# EAGLE design MegaShield-SMD (EAGLE 8.5.0)
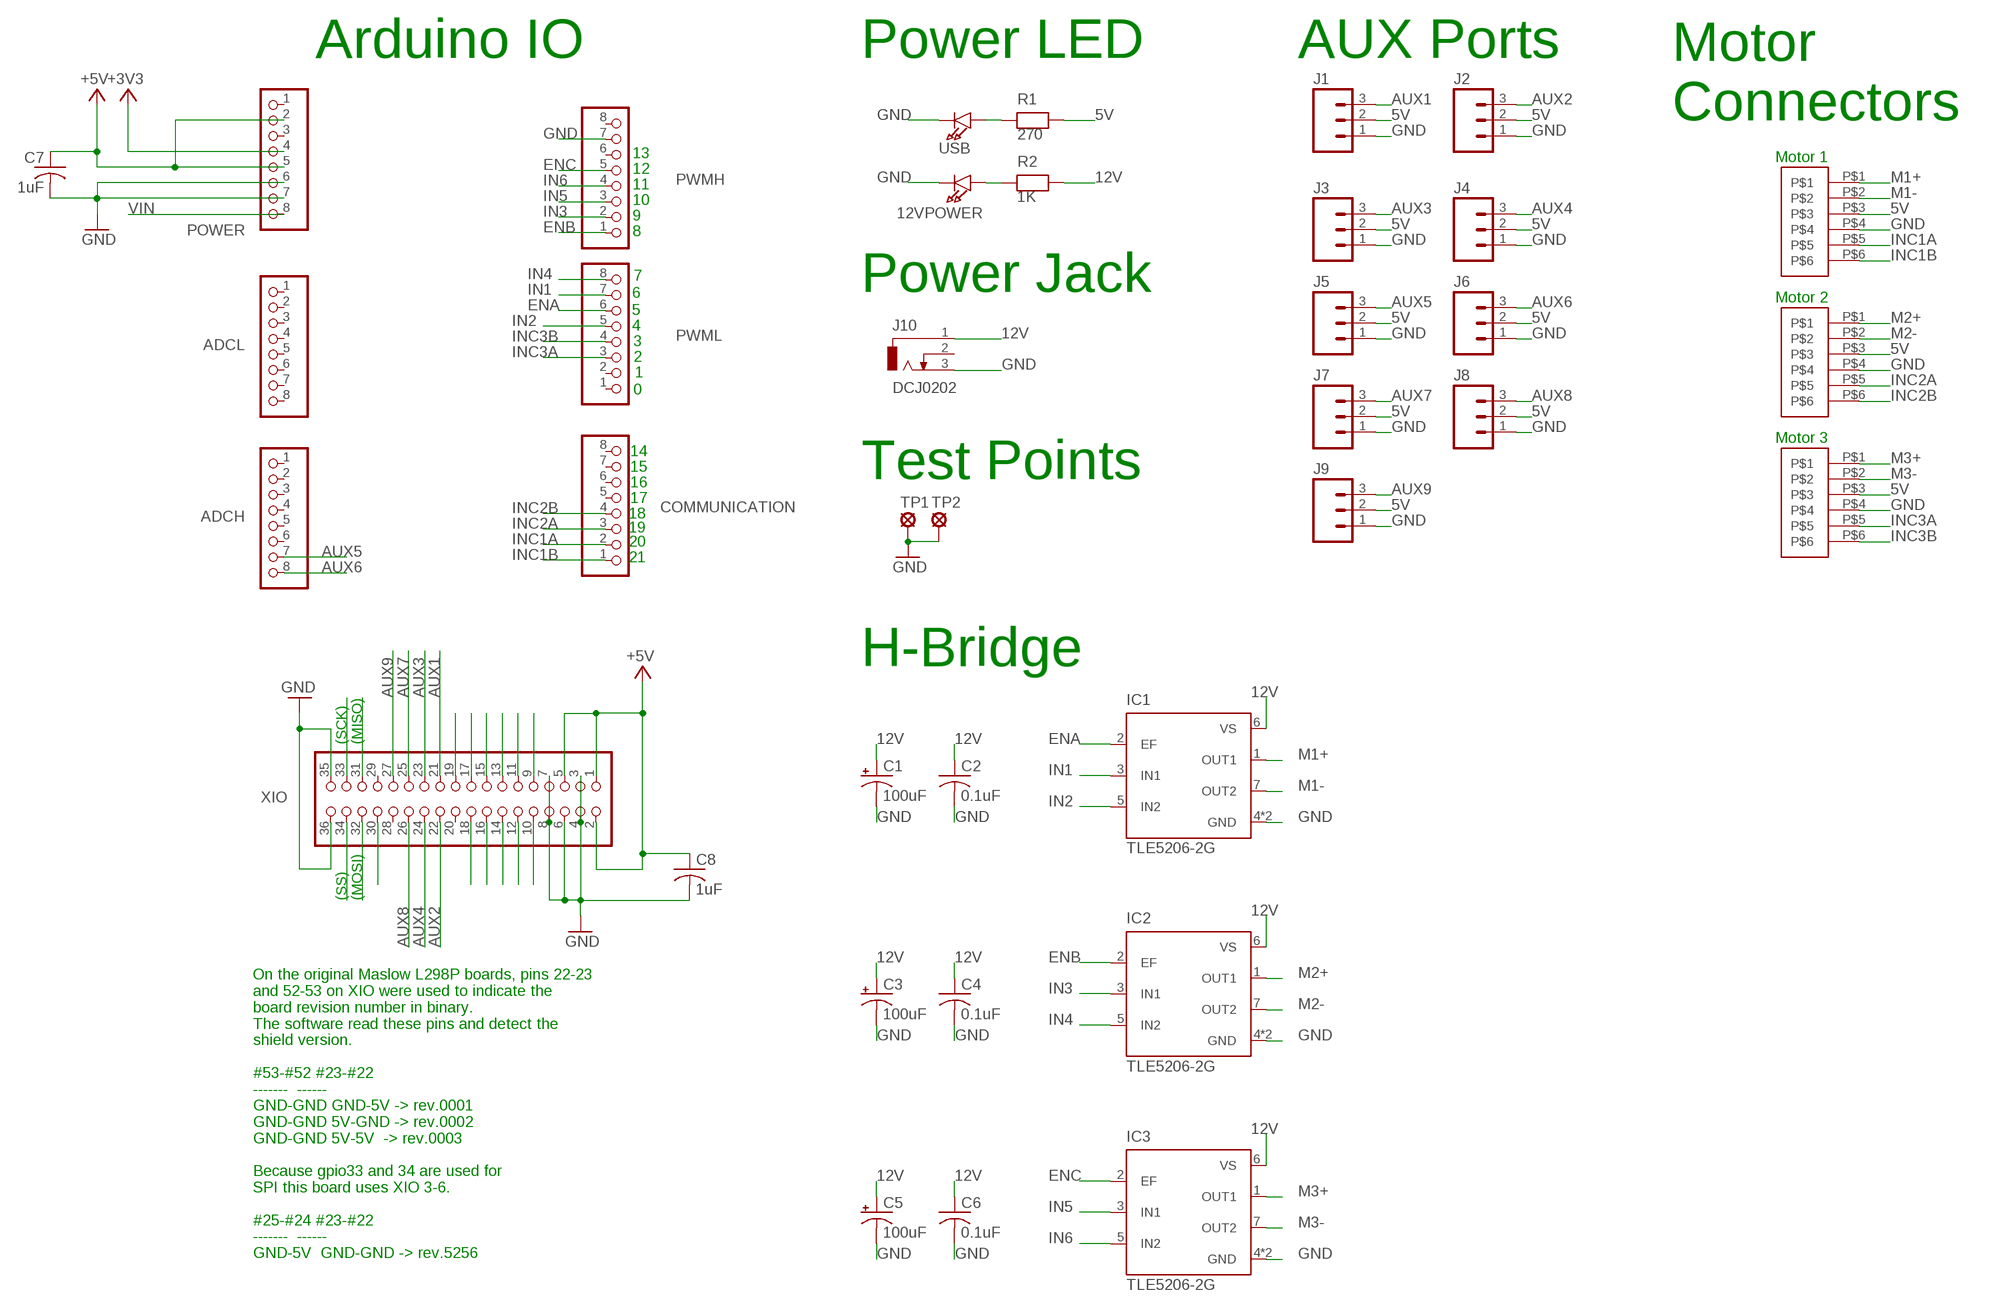
[diagram p0: schematic, sheet 1]

## Parts
12VPOWER  LED1206  [CHIPLED_1206]
ADCH  8x1F-H8.5  PINHD-1X8  [1X08]
ADCL  PINHD-1X8  [1X08]
C1  100uF  CAP_POLE  [PANASONIC_E]
C2  0.1uF  C-USC0805K  [C0805K]
C3  100uF  CAP_POLE  [PANASONIC_E]
C4  0.1uF  C-USC0805K  [C0805K]
C5  100uF  CAP_POLE  [PANASONIC_E]
C6  0.1uF  C-USC0805K  [C0805K]
C7  1uF  C-USC0805K  [C0805K]
C8  1uF  C-USC0805K  [C0805K]
COMMUNICATION  PINHD-1X8  [1X08]
IC1  TLE5206-2G  [INF-PG-TO263-7-1_L_1PRIMARY]
IC2  TLE5206-2G  [INF-PG-TO263-7-1_L_1PRIMARY]
IC3  TLE5206-2G  [INF-PG-TO263-7-1_L_1PRIMARY]
J1  M03LOCK  [1X03_LOCK]
J2  M03LOCK  [1X03_LOCK]
J3  M03LOCK  [1X03_LOCK]
J4  M03LOCK  [1X03_LOCK]
J5  M03LOCK  [1X03_LOCK]
J6  M03LOCK  [1X03_LOCK]
J7  M03LOCK  [1X03_LOCK]
J8  M03LOCK  [1X03_LOCK]
J9  M03LOCK  [1X03_LOCK]
J10  DCJ0202  [DCJ0202]
MP1  JST-PH-6  [JST-PHR-6-SMD]
MP2  JST-PH-6  [JST-PHR-6-SMD]
MP3  JST-PH-6  [JST-PHR-6-SMD]
POWER  8x1F-H8.5  PINHD-1X8  [1X08]
PWMH  PINHD-1X8  [1X08]
PWML  PINHD-1X8  [1X08]
R1  270  RESISTOR0805  [0805]
R2  1K  RESISTOR0805  [0805]
TP1  LSP10  [LSP10]
TP2  LSP10  [LSP10]
USB  LED1206  [CHIPLED_1206]
XIO  18x2F-H8.5  PINHD-2X18  [2X18]

## Nets
5V: C7.1 C8.1 J1.2 J2.2 J3.2 J4.2 J5.2 J6.2 J7.2 J8.2 J9.2 MP1.P$3 MP2.P$3 MP3.P$3 POWER.2 POWER.5 R1.2 XIO.1 XIO.2 XIO.5 ; supply symbol labelled +5V
12V: C1.+ C2.1 C3.+ C4.1 C5.+ C6.1 IC1.6(VS) IC2.6(VS) IC3.6(VS) J10.1 R2.2
+3V3 [power]: POWER.4
AUX1: J1.3 XIO.21
AUX2: J2.3 XIO.22
AUX3: J3.3 XIO.23
AUX4: J4.3 XIO.24
AUX5: ADCH.7 J5.3
AUX6: ADCH.8 J6.3
AUX7: J7.3 XIO.25
AUX8: J8.3 XIO.26
AUX9: J9.3 XIO.27
ENA: IC1.2(EF) PWML.6
ENB: IC2.2(EF) PWMH.1
ENC: IC3.2(EF) PWMH.5
GND [gnd]: 12VPOWER.C C1.- C2.2 C3.- C4.2 C5.- C6.2 C7.2 C8.2 IC1.4(GND) IC1.8(GND) IC2.4(GND) IC2.8(GND) IC3.4(GND) IC3.8(GND) J1.1 J2.1 J3.1 J4.1 J5.1 J6.1 J7.1 J8.1 J9.1 J10.3 MP1.P$4 MP2.P$4 MP3.P$4 POWER.6 POWER.7 PWMH.7 TP1.MP TP2.MP USB.C XIO.3 XIO.4 XIO.6 XIO.7 XIO.8 XIO.35 XIO.36
IN1: IC1.3(IN1) PWML.7
IN2: IC1.5(IN2) PWML.5
IN3: IC2.3(IN1) PWMH.2
IN4: IC2.5(IN2) PWML.8
IN5: IC3.3(IN1) PWMH.3
IN6: IC3.5(IN2) PWMH.4
INC1A: COMMUNICATION.2 MP1.P$5
INC1B: COMMUNICATION.1 MP1.P$6
INC2A: COMMUNICATION.3 MP2.P$5
INC2B: COMMUNICATION.4 MP2.P$6
INC3A: MP3.P$5 PWML.3
INC3B: MP3.P$6 PWML.4
M1+: IC1.1(OUT1) MP1.P$1
M1-: IC1.7(OUT2) MP1.P$2
M2+: IC2.1(OUT1) MP2.P$1
M2-: IC2.7(OUT2) MP2.P$2
M3+: IC3.1(OUT1) MP3.P$1
M3-: IC3.7(OUT2) MP3.P$2
N$2: R1.1 USB.A
N$3: 12VPOWER.A R2.1
PA6: XIO.9
PA7: XIO.10
PB0: XIO.34
PB1: XIO.33
PB2: XIO.32
PB3: XIO.31
PC0: XIO.18
PC1: XIO.17
PC2: XIO.16
PC3: XIO.15
PC4: XIO.14
PC5: XIO.13
PC6: XIO.12
PC7: XIO.11
PD7: XIO.19
PL0: XIO.30
VIN [power]: POWER.8
Unconnected: ADCH.1 ADCH.2 ADCH.3 ADCH.4 ADCH.5 ADCH.6 ADCL.1 ADCL.2 ADCL.3 ADCL.4 ADCL.5 ADCL.6 ADCL.7 ADCL.8 COMMUNICATION.5 COMMUNICATION.6 COMMUNICATION.7 COMMUNICATION.8 J10.2 POWER.1 POWER.3 PWMH.6 PWMH.8 PWML.1 PWML.2 XIO.20 XIO.28 XIO.29

## Notes on the sheet
- Arduino IO | Power LED | AUX Ports
- Motor
  Connectors
- Motor 1
- 13
- 12
- 11
- 10
- 9
- 8
- 7
- Power Jack | Motor 2
- 6
- 5
- 4
- 3
- 2
- 1
- 0
- Motor 3
- 14
- 15
- Test Points
- 16
- 17
- 18
- 19
- 20
- 21
- H-Bridge
- (SCK) | (MISO)
- (SS) | (MOSI)
- On the original Maslow L298P boards, pins 22-23
  and 52-53 on XIO were used to indicate the 
  board revision number in binary. 
  The software read these pins and detect the 
  shield version.
  
  #53-#52 #23-#22
  -------  ------
  GND-GND GND-5V -> rev.0001
  GND-GND 5V-GND -> rev.0002
  GND-GND 5V-5V  -> rev.0003
  
  Because gpio33 and 34 are used for 
  SPI this board uses XIO 3-6.
  
  #25-#24 #23-#22
  -------  ------
  GND-5V  GND-GND -> rev.5256

## Library data of the parts
12VPOWER USB = microbuilder:LED: LED 0603 - 0603 Surface Mount Package Green LED - Low Power (3.9mcd, 2ma, 1.7Vf) Orange LED - Low Power (9.8mcd, 2ma, 1.8Vf) Red LED - Low Power (5mcd, 2ma, 1.8Vf) Yellow LED - Low Power (7mcd, 2ma, 1.8Vf) 0805 - 0805 Surface Mount Package Red LED (104mcd, 20mA, Diffused) - LS R976 [Digikey: 475-1278-6-ND] Red LED (12mcd, 20mA, 2.0Vf, Clear) - APT2012EC [Digikey: 754-1128-1-ND] Green LED (15mcd, 20mA, 2.2Vf, Clear) - APT2012GC [Digikey: 754-1131-1-ND] White LED (160mcd, 20mA, 2.1Vf, Clear) - APT2012SECK [Digikey: 754-1130-1-ND] 1206 - 1206 Surface Mount Package Green LED (26mcd, 20mA, Diffused) - LG N971 [Digikey: 475-1407-6-ND] Red LED (15mcd, 20mA, Diffused) - LH N974 [Digikey: 475-1416-6-ND]
ADCH POWER = SmartPrj:PINHD-1X8: PIN HEADER
ADCL COMMUNICATION PWMH PWML = pinhead:PINHD-1X8: PIN HEADER
C1 C3 C5 = SparkFun:CAP_POL: Capacitor Polarized These are standard SMD and PTH capacitors. Normally 10uF, 47uF, and 100uF in electrolytic and tantalum varieties. Always verify the external diameter of the through hole cap, it varies with capacity, voltage, and manufacturer. The EIA devices should be standard.
C2 C4 C6-C8 = adafruit:C-US: CAPACITOR, American symbol
IC1 IC2 = TLE5206-fixed:TLE5206-2G: PG-TO263-7-1 package , TAB is GND
IC3 = TLE5206-fixed:TLE5206-2G: PG-TO263-7-1 package , TAB is GND; DIGIKEY: TLE5206-2S-ND
J1-J9 = SparkFun-Connectors:M03: Header 3 Standard 3-pin 0.1" header. Use with straight break away headers (SKU : PRT-00116), right angle break away headers (PRT-00553), swiss pins (PRT-00743), machine pins (PRT-00117), and female headers (PRT-00115). Molex polarized connector foot print use with SKU : PRT-08232 with associated crimp pins and housings.
J10 = con-jack:DCJ0202: DC POWER JACK Source: DCJ0202.pdf; OC_FARNELL: unknown; OC_NEWARK: unknown
MP1-MP3 = JST-CON:JST-PH-6
R1 R2 = microbuilder:RESISTOR: Resistors 0603 - 0603 Surface Mount Package 0 Ohm 1/10 Watt 1% Resistor 15 Ohm 1/10 Watt 1% Resistor 33 Ohm 1/10 Watt 1% Resistor 49.9 Ohm 1/10 Watt 1% Resistor 100 Ohm 1/10 Watt 1% Resistor 150 Ohm 1/10 Watt 1% Resistor 240 Ohm 1/10 Watt 1% Resistor 390 Ohm 1/10 Watt 1% Resistor 560 Ohm 1/10 Watt 1% Resistor 1.0K Ohm 1/10 Watt 1% Resistor 1.5K Ohm 1/10 Watt 1% Resistor 2.0K Ohm 1/10 Watt 1% Resistor 10.0K Ohm 1/10 Watt 1% Resistor 20.0K Ohm 1/10 Watt 1% Resistor 33.0K Ohm 1/10 Watt 1% Resistor 100.0K Ohm 1/10 Watt 1% Resistor 0805 - 0805 Surface Mount Package 0 Ohm 1/8 Watt 1% Resistor 33 Ohm 1/8 Watt 1% Resistor 100 Ohm 1/8 Watt 1% Resistor 150 Ohm 1/8 Watt 1% Resistor 200 Ohm 1/8 Watt 1% Resistor 240 Ohm 1/8 Watt 1% Resistor 330 Ohm 1/8 Watt 1% Resistor 390 Ohm 1/8 Watt 1% Resistor 470 Ohm 1/8 Watt 1% Resistor 1.0K Ohm 1/8 Watt 1% Resistor 1.5K Ohm 1/8 Watt 1% Resistor 2.0K Ohm 1/8 Watt 1% Resistor 4.7K Ohm 1/8 Watt 1% Resistor 5.1K Ohm 1/8 Watt 1% Resistor 5.6K Ohm 1/8 Watt 1% Resistor 10.0K Ohm 1/8 Watt 1% Resistor 22.0K Ohm 1/8 Watt 1% Resistor 33.0K Ohm 1/8 Watt 1% Resistor 100K Ohm 1/8 Watt 1% Resistor 1206 - 1206 Surface Mount Package
TP1 TP2 = solpad:LSP10: SOLDER PAD drill 1.0 mm, distributor Buerklin, 12H555
XIO = SmartPrj:PINHD-2X18: PIN HEADER

## Net classes
1 power: width 0.61 mm, drill 0.711 mm, clearance 0.203 mm
2 gnd: width 0.305 mm, drill 0.711 mm, clearance 0.203 mm
3 usbvcc: width 0.508 mm, drill 0.711 mm, clearance 0.203 mm

## Board
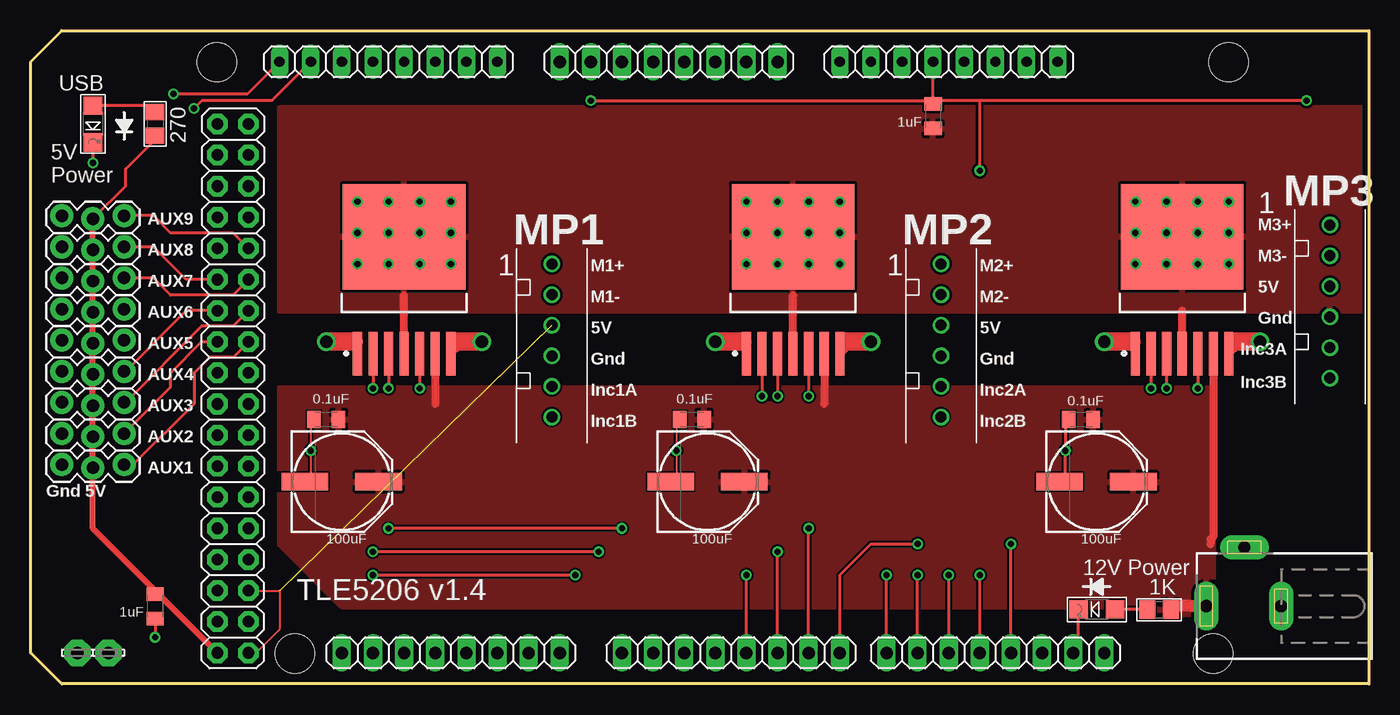
[diagram p1: board, top side]
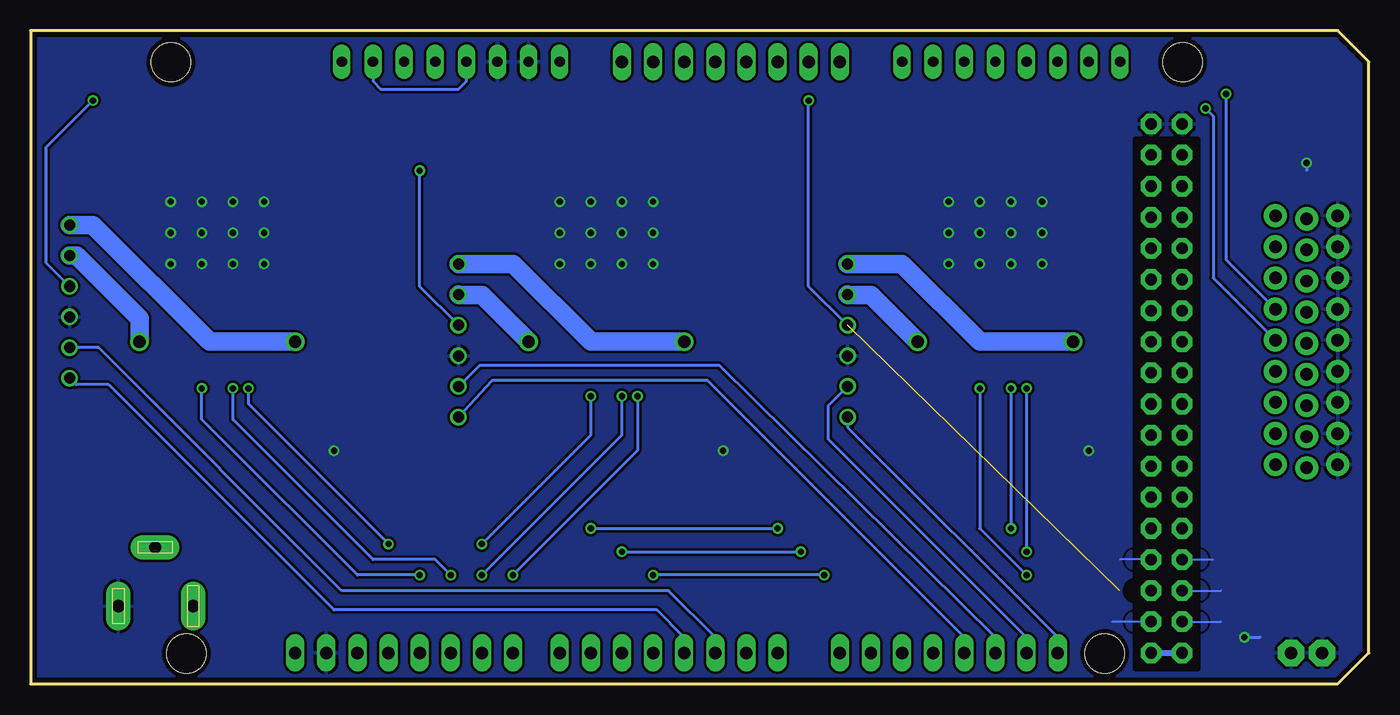
[diagram p2: board, bottom side, seen from below]

Size 109.22 x 53.34 mm. Coordinates in mm from the lower left corner, seen from the top.
Outline: 2.54,0 0,2.54 0,50.8 2.53,53.34 109.22,53.34 109.22,0 2.54,0
Copper layers (1*16): Top 0.0356mm / dielectric 1.5011mm / Bottom 0.0356mm
Design rules "PCBs_io *": minimum track width 6mil, minimum drill 13mil, track to track 6mil, track to pad 6mil, pad to pad 6mil, via to via 6mil, smd to smd 6mil, copper to edge 15mil, drill to drill 6mil, minimum pad ring 7mil, minimum via ring 7mil, stop-mask expansion 3mil, vias tented up to drill 0mil, thermal gap 10mil
Holes 3.2 mm at 15.22,50.76 96.5,2.5 21.57,2.5 97.77,50.76
tRestrict: area 13,6.7 to 14.9,8.6; area 13,4.1 to 14.9,6; area 18.1,4.1 to 20,6; area 18.1,6.7 to 20,8.6; area 13,9.2 to 14.9,11.1; area 18.1,9.2 to 20,11.1
bRestrict: area 14,1.3 to 19.1,44.5; area 13,9.2 to 14.9,11.1; area 18.1,9.2 to 20,11.1; area 18.1,6.7 to 20,8.6; area 18.1,4.1 to 20,6; area 13,4.1 to 14.9,6; area 13,6.7 to 14.9,8.6

### Footprints (pad centres in the part's own frame; a part is rotated, then mirrored left to right if it is on the bottom)
CHIPLED_1206 = smd 1.5 x 1.5: A 0,-1.496; C 0,1.496
1X08 = drill 0.85 pad 1.422 long: 1 -8.89,0; 2 -6.35,0; 3 -3.81,0; 4 -1.27,0; 5 1.27,0; 6 3.81,0; 7 6.35,0; 8 8.89,0
1X08' = drill 1.016 long: 1 -8.89,0; 2 -6.35,0; 3 -3.81,0; 4 -1.27,0; 5 1.27,0; 6 3.81,0; 7 6.35,0; 8 8.89,0
PANASONIC_E = smd 3.8 x 1.4: + 3,0; - -3,0
C0805K = smd 1.1 x 1.4: 1 -1,0; 2 1,0
INF-PG-TO263-7-1_L_1PRIMARY = smd 3.55 x 0.75: 1 -6.05,3.81; 2 -6.05,2.54; 3 -6.05,1.27; 4 -6.05,0; 5 -6.05,-1.27; 6 -6.05,-2.54; 7 -6.05,-3.81 | smd 8.6 x 10: 8 3.5,0
1X03_LOCK = drill 1.016 pad 1.88: 1 0,0.127; 2 2.54,-0.127; 3 5.08,0.127
DCJ0202 = drill 1 pad 2 long: 1 0,3.1; 2 4.8,0; 3 0,-3
JST-PHR-6-SMD = drill 0.9: P$1 0,0; P$2 2.5,0; P$3 5,0; P$4 7.5,0; P$5 10,0; P$6 12.5,0
0805 = smd 1.3 x 1.5: 1 -0.95,0; 2 0.95,0
LSP10 = drill 1.016 pad 2.159 octagon: MP 0,0
2X18 = drill 0.95 pad 1.676 octagon: 1 -21.59,-1.27; 2 -21.59,1.27; 3 -19.05,-1.27; 4 -19.05,1.27; 5 -16.51,-1.27; 6 -16.51,1.27; 7 -13.97,-1.27; 8 -13.97,1.27; 9 -11.43,-1.27; 10 -11.43,1.27; 11 -8.89,-1.27; 12 -8.89,1.27; 13 -6.35,-1.27; 14 -6.35,1.27; 15 -3.81,-1.27; 16 -3.81,1.27; 17 -1.27,-1.27; 18 -1.27,1.27; 19 1.27,-1.27; 20 1.27,1.27; 21 3.81,-1.27; 22 3.81,1.27; 23 6.35,-1.27; 24 6.35,1.27; 25 8.89,-1.27; 26 8.89,1.27; 27 11.43,-1.27; 28 11.43,1.27; 29 13.97,-1.27; 30 13.97,1.27; 31 16.51,-1.27; 32 16.51,1.27; 33 19.05,-1.27; 34 19.05,1.27; 35 21.59,-1.27; 36 21.59,1.27

### Placement (x,y rotation side)
12VPOWER  87.02,6.09 90 top
ADCH  29.21,50.8 180 top
ADCL  [1X08']  52.07,50.8 0 top
C1  25.4,16.51 0 top
C2  24.13,21.59 180 top
C3  55.24,16.51 0 top
C4  53.98,21.59 180 top
C5  87,16.51 0 top
C6  85.72,21.59 180 top
C7  10.16,6.35 270 top
C8  73.66,46.35 270 top
COMMUNICATION  [1X08']  34.29,2.54 0 top
IC1  30.48,33.02 90 top
IC2  62.23,33.02 90 top
IC3  93.98,33.02 90 top
J1  2.54,17.78 0 top
J2  2.54,20.32 0 top
J3  2.54,22.86 0 top
J4  2.54,25.4 0 top
J5  2.54,27.94 0 top
J6  2.54,30.48 0 top
J7  2.54,33.02 0 top
J8  2.54,35.56 0 top
J9  2.54,38.1 0 top
J10  99.06,6.35 90 top
MP1  42.55,34.29 270 top
MP2  74.3,34.29 270 top
MP3  106.05,37.47 270 top
POWER  74.93,50.8 180 top
PWMH  [1X08']  78.74,2.54 0 top
PWML  [1X08']  57.15,2.54 0 top
R1  10.16,45.72 270 top
R2  92.1,6.07 0 top
TP1  3.81,2.54 0 top
TP2  6.35,2.54 0 top
USB  5.08,45.72 180 top
XIO  16.51,24.13 90 top

### Tracks (layer width: path | path; a pad name or v marks a point on that pad's centre or on a via)
5V  (via drill 0.51)  (1 unrouted)
  Top 0.152: XIO.5 20.32,7.62 20.32,4.45 18.41,2.54 XIO.1 | C7.1 10.16,7.62
  Top 0.254: v45.72,47.62 73.66,47.62 | 73.66,47.62 C8.1 POWER.5 | J9.2 7.75,40.64 7.75,42.04 10.16,44.45 R1.2 | v104.14,47.62 77.47,47.62 | 77.47,47.62 73.66,47.62 | v77.47,41.91 77.47,47.62
  Top 0.508: XIO.2 10.16,7.62 5.08,12.7 J1.2 J2.2 J3.2 J4.2 J5.2 J6.2 J7.2 J8.2 J9.2
  Bottom 0.254: POWER.2 81.28,49.21 80.64,48.58 74.3,48.58 73.66,49.21 POWER.5 | MP1.P$3 45.72,32.47 v45.72,47.62 | MP2.P$3 77.47,32.47 v77.47,41.91 | MP3.P$3 107.95,34.37 107.95,43.81 v104.14,47.62
  Bottom 0.508: XIO.1 XIO.2
12V
  Top 0.254: R2.2 93.39,6.41
  Top 0.635: IC1.6 33.02,22.86 | IC2.6 64.77,22.86 | IC3.6 96.52,12.02 96.32,11.82 96.32,11.43
  Top 1.016: 93.39,6.41 J10.1
  pour Top: 20.32,24.13 20.32,11.43 25.4,6.35 88.9,6.35 90.81,5.71 96.52,5.71 96.52,24.13
AUX1
  Top 0.254: XIO.21 16.51,26.67 14.61,26.67 13.34,25.4 13.34,22.86 8.38,17.91 J1.3
AUX2
  Top 0.254: J2.3 11.43,24.26 11.43,25.4 13.97,27.94 XIO.22
AUX3
  Top 0.254: XIO.23 16.51,29.21 13.97,29.21 7.62,22.86 J3.3
AUX4
  Top 0.254: XIO.24 12.7,30.48 7.62,25.4 J4.3
AUX5  (via drill 0.51)
  Top 0.254: ADCH.7 19.68,47.62 13.97,47.62 v13.34,46.99
  Bottom 0.254: v13.34,46.99 12.7,46.35 12.7,33.15 J5.3
AUX6  (via drill 0.51)
  Top 0.254: v11.66,48.18 17.7,48.18 ADCH.8
  Bottom 0.254: J6.3 11.66,34.65 v11.66,48.18
AUX7
  Top 0.254: XIO.25 16.51,31.75 11.43,31.75 10.03,33.15 J7.3
AUX8
  Top 0.254: XIO.26 12.7,33.02 10.03,35.69 J8.3
AUX9
  Top 0.254: XIO.27 16.51,36.83 11.43,36.83 10.03,38.23 J9.3
ENA  (via drill 0.51)
  Top 0.254: PWML.6 v60.96,10.79 | IC1.2 v27.94,24.13 | v46.35,10.79 v27.94,10.79
  Bottom 0.254: v27.94,24.13 v27.94,10.79 | v60.96,10.79 v46.35,10.79
ENB  (via drill 0.51)
  Top 0.254: PWMH.1 v69.85,8.89 | IC2.2 v59.69,23.5
  Bottom 0.254: v69.85,8.89 59.69,19.05 v59.69,23.5
ENC  (via drill 0.51)
  Top 0.254: IC3.2 v91.44,24.13 | PWMH.5 v80.01,11.43
  Bottom 0.254: v80.01,11.43 91.44,22.86 v91.44,24.13
GND  (via drill 0.51)
  Top 0.152: C2.2 22.86,21.32 v22.86,19.05 22.86,16.51 C1.- | C4.2 52.7,21.59 v52.7,19.05 52.7,16.51 C3.-
  Top 0.254: PWMH.7 85.52,2.97 12VPOWER.C | C5.- 84.45,16.51 v84.45,19.05 84.45,21.32 arc-90 C6.2 | C7.2 v10.16,3.81 | USB.C v5.08,42.55
  Top 0.635: IC3.4 93.98,30.48 | IC2.4 62.23,31.75 | IC1.4 30.48,31.75
  Bottom 0.152: XIO.4 12.06,5.08 | XIO.3 20.95,5.08 | XIO.6 12.06,7.62 | XIO.8 12.7,10.16 | XIO.7 20.32,10.16
  Bottom 0.254: v10.16,3.81 8.89,3.81 | v5.08,42.55 5.08,41.91
  other vias: 26.67,39.37 29.21,39.37 31.75,39.37 34.29,39.37 26.67,36.83 29.21,36.83 31.75,36.83 34.29,36.83 26.67,34.29 29.21,34.29 31.75,34.29 34.29,34.29 58.42,39.37 60.96,39.37 63.5,39.37 66.04,39.37 58.42,36.83 60.96,36.83 63.5,36.83 66.04,36.83 58.42,34.29 60.96,34.29 63.5,34.29 66.04,34.29 90.17,39.37 92.71,39.37 95.25,39.37 97.79,39.37 90.17,36.83 92.71,36.83 95.25,36.83 97.79,36.83 90.17,34.29 92.71,34.29 95.25,34.29 97.79,34.29
  pour Bottom: 2.54,53.34 109.22,53.34 109.22,0 2.54,0 0,2.54 0,50.8
  pour Top: 20.32,46.99 20.32,30.48 109.22,30.48 109.22,46.99
IN1  (via drill 0.51)
  Top 0.254: PWML.7 v63.5,12.7 | IC1.3 v29.21,24.13 | v48.26,12.7 v29.21,12.7
  Bottom 0.254: v29.21,24.13 v29.21,12.7 | v63.5,12.7 v48.26,12.7
IN2  (via drill 0.51)
  Top 0.254: PWML.5 v58.42,8.89 | v27.94,8.89 v44.45,8.89 | IC1.5 v31.75,24.13
  Bottom 0.254: v31.75,24.13 31.75,12.7 v27.94,8.89 | v44.45,8.89 v58.42,8.89
IN3  (via drill 0.51)
  Top 0.254: IC2.3 v60.96,23.5 | PWMH.2 v72.39,8.89
  Bottom 0.254: v72.39,8.89 60.96,20.32 v60.96,23.5
IN4  (via drill 0.51)
  Top 0.254: IC2.5 v63.5,23.5 | PWML.8 66.04,8.89 68.58,11.43 v72.39,11.43
  Bottom 0.254: v72.39,11.43 63.5,20.32 v63.5,23.5
IN5  (via drill 0.51)
  Top 0.254: IC3.3 v92.71,24.13 | PWMH.3 v74.93,8.89
  Bottom 0.254: v74.93,8.89 76.2,10.16 81.28,10.16 92.71,21.59 v92.71,24.13
IN6  (via drill 0.51)
  Top 0.254: IC3.5 v95.25,24.13 | PWMH.4 v77.47,8.89
  Bottom 0.254: v77.47,8.89 82.55,8.89 93.98,20.32 95.25,21.59 v95.25,24.13
INC1A
  Bottom 0.254: COMMUNICATION.2 27.94,3.81 44.13,20 44.13,22.7 MP1.P$5
INC1B
  Bottom 0.254: MP1.P$6 42.55,20.95 25.4,3.81 COMMUNICATION.1
INC2A
  Bottom 0.254: MP2.P$5 72.55,26.04 53.02,26.04 30.48,3.81 COMMUNICATION.3
INC2B
  Bottom 0.254: COMMUNICATION.4 33.02,3.81 53.98,24.77 71.56,24.77 MP2.P$6
INC3A
  Bottom 0.254: PWML.3 53.34,3.81 57.15,7.62 83.82,7.62 103.67,27.46 MP3.P$5
INC3B
  Bottom 0.254: PWML.4 55.88,3.81 58.1,6.03 84.45,6.03 102.87,24.44 105.52,24.44 MP3.P$6
M1+  (via drill 1.02)
  Top 0.635: 26.04,27.94 26.67,27.3 IC1.1
  Top 1.524: v24.13,27.94 26.04,27.94 26.35,27.94
  Bottom 1.524: v24.13,27.94 31.75,27.94 38.1,34.29 MP1.P$1
M1-  (via drill 1.02)
  Top 0.635: 34.92,27.94 34.92,27.61 IC1.7
  Top 1.524: v36.83,27.94 34.92,27.94
  Bottom 1.524: MP1.P$2 42.51,31.75 40.64,31.75 v36.83,27.94
M2+  (via drill 1.02)
  Top 0.635: 57.78,27.94 58.42,27.3 IC2.1
  Top 1.524: v55.88,27.94 57.78,27.94 58.1,27.94
  Bottom 1.524: MP2.P$1 69.85,34.29 63.5,27.94 v55.88,27.94
M2-  (via drill 1.02)
  Top 0.635: 66.67,27.94 66.67,27.61 IC2.7
  Top 1.524: v68.58,27.94 66.67,27.94
  Bottom 1.524: MP2.P$2 74.25,31.75 72.39,31.75 v68.58,27.94
M3+  (via drill 1.02)
  Top 0.635: 89.53,27.94 90.17,27.3 IC3.1
  Top 1.524: v87.63,27.94 89.53,27.94 89.85,27.94
  Bottom 1.524: MP3.P$1 104.14,37.47 94.61,27.94 v87.63,27.94
M3-  (via drill 1.02)
  Top 0.635: 98.42,27.94 98.42,27.61 IC3.7
  Top 1.524: v100.33,27.94 98.42,27.94
  Bottom 1.524: MP3.P$2 105.45,34.97 100.33,29.84 v100.33,27.94
N$2
  Top 0.254: R1.1 9.61,47.22 USB.A
N$3
  Top 0.254: R2.1 91.13,6.09 12VPOWER.A

### Text on the board
tPlace: 5V / Power | MP3 | 1 | AUX9 | M3+ | MP1 | MP2 | AUX8 | M1+ | M2+ | M3- | 1 | 1 | AUX7 | 5V | M1- | M2- | AUX6 | 5V | 5V | Gnd | AUX5 | Inc3A | Gnd | Gnd | AUX4 | Inc3B | Inc1A | Inc2A | AUX3 | Inc1B | Inc2B | AUX2 | AUX1 | Gnd | 5V | 12V Power | TLE5206 v1.4